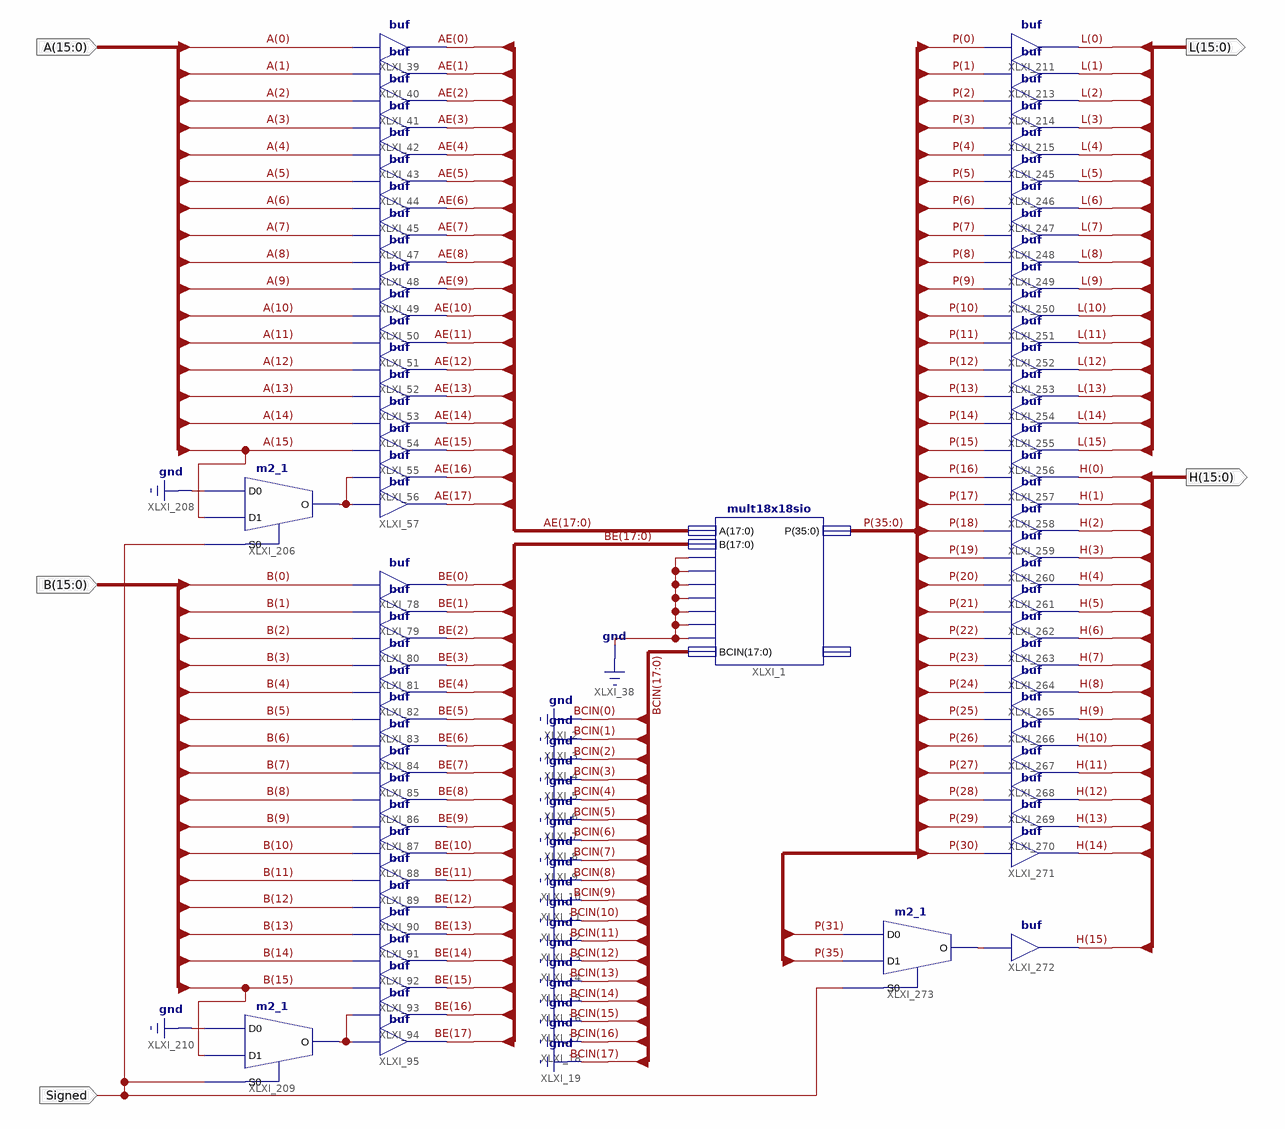
[diagram p0: schematic sheet 1]
// Xilinx ISE schematic mult.sch (spartan6) as structural Verilog: 72 symbols, 5 ports
module mult (
  input  [15:0] A,
  input  [15:0] B,
  input  Signed,
  output [15:0] L,
  output [15:0] H
);

  wire XLXN_188, XLXN_210, XLXN_253;
  wire [17:0] AE, BE;
  wire [35:0] P;

  mult18x18sio XLXI_1 (
    .A(AE), .B(BE), .CEA(1'b0), .CEB(1'b0), .CEP(1'b0), .CLK(1'b0), .RSTA(1'b0), .RSTB(1'b0), .RSTP(1'b0),
    .BCIN({18{1'b0}}), .P(P));  // open: BCOUT
  buf XLXI_78 (BE[0], B[0]);
  buf XLXI_79 (BE[1], B[1]);
  buf XLXI_80 (BE[2], B[2]);
  buf XLXI_81 (BE[3], B[3]);
  buf XLXI_82 (BE[4], B[4]);
  buf XLXI_83 (BE[5], B[5]);
  buf XLXI_84 (BE[6], B[6]);
  buf XLXI_85 (BE[7], B[7]);
  buf XLXI_86 (BE[8], B[8]);
  buf XLXI_87 (BE[9], B[9]);
  buf XLXI_88 (BE[10], B[10]);
  buf XLXI_89 (BE[11], B[11]);
  buf XLXI_90 (BE[12], B[12]);
  buf XLXI_91 (BE[13], B[13]);
  buf XLXI_92 (BE[14], B[14]);
  buf XLXI_93 (BE[15], B[15]);
  buf XLXI_94 (BE[16], XLXN_210);
  buf XLXI_95 (BE[17], XLXN_210);
  buf XLXI_39 (AE[0], A[0]);
  buf XLXI_40 (AE[1], A[1]);
  buf XLXI_41 (AE[2], A[2]);
  buf XLXI_42 (AE[3], A[3]);
  buf XLXI_43 (AE[4], A[4]);
  buf XLXI_44 (AE[5], A[5]);
  buf XLXI_45 (AE[6], A[6]);
  buf XLXI_47 (AE[7], A[7]);
  buf XLXI_48 (AE[8], A[8]);
  buf XLXI_49 (AE[9], A[9]);
  buf XLXI_50 (AE[10], A[10]);
  buf XLXI_51 (AE[11], A[11]);
  buf XLXI_52 (AE[12], A[12]);
  buf XLXI_53 (AE[13], A[13]);
  buf XLXI_54 (AE[14], A[14]);
  buf XLXI_55 (AE[15], A[15]);
  buf XLXI_56 (AE[16], XLXN_188);
  buf XLXI_57 (AE[17], XLXN_188);
  m2_1 XLXI_206 (.D0(1'b0), .D1(A[15]), .S0(Signed), .O(XLXN_188));
  m2_1 XLXI_209 (.D0(1'b0), .D1(B[15]), .S0(Signed), .O(XLXN_210));
  buf XLXI_211 (L[0], P[0]);
  buf XLXI_213 (L[1], P[1]);
  buf XLXI_214 (L[2], P[2]);
  buf XLXI_215 (L[3], P[3]);
  buf XLXI_245 (L[4], P[4]);
  buf XLXI_246 (L[5], P[5]);
  buf XLXI_247 (L[6], P[6]);
  buf XLXI_248 (L[7], P[7]);
  buf XLXI_249 (L[8], P[8]);
  buf XLXI_250 (L[9], P[9]);
  buf XLXI_251 (L[10], P[10]);
  buf XLXI_252 (L[11], P[11]);
  buf XLXI_253 (L[12], P[12]);
  buf XLXI_254 (L[13], P[13]);
  buf XLXI_255 (L[14], P[14]);
  buf XLXI_256 (L[15], P[15]);
  buf XLXI_257 (H[0], P[16]);
  buf XLXI_258 (H[1], P[17]);
  buf XLXI_259 (H[2], P[18]);
  buf XLXI_260 (H[3], P[19]);
  buf XLXI_261 (H[4], P[20]);
  buf XLXI_262 (H[5], P[21]);
  buf XLXI_263 (H[6], P[22]);
  buf XLXI_264 (H[7], P[23]);
  buf XLXI_265 (H[8], P[24]);
  buf XLXI_266 (H[9], P[25]);
  buf XLXI_267 (H[10], P[26]);
  buf XLXI_268 (H[11], P[27]);
  buf XLXI_269 (H[12], P[28]);
  buf XLXI_270 (H[13], P[29]);
  buf XLXI_271 (H[14], P[30]);
  buf XLXI_272 (H[15], XLXN_253);
  m2_1 XLXI_273 (.D0(P[31]), .D1(P[35]), .S0(Signed), .O(XLXN_253));
endmodule
